# EAGLE schematic LEDSlave 5 (EAGLE 7.6.0)
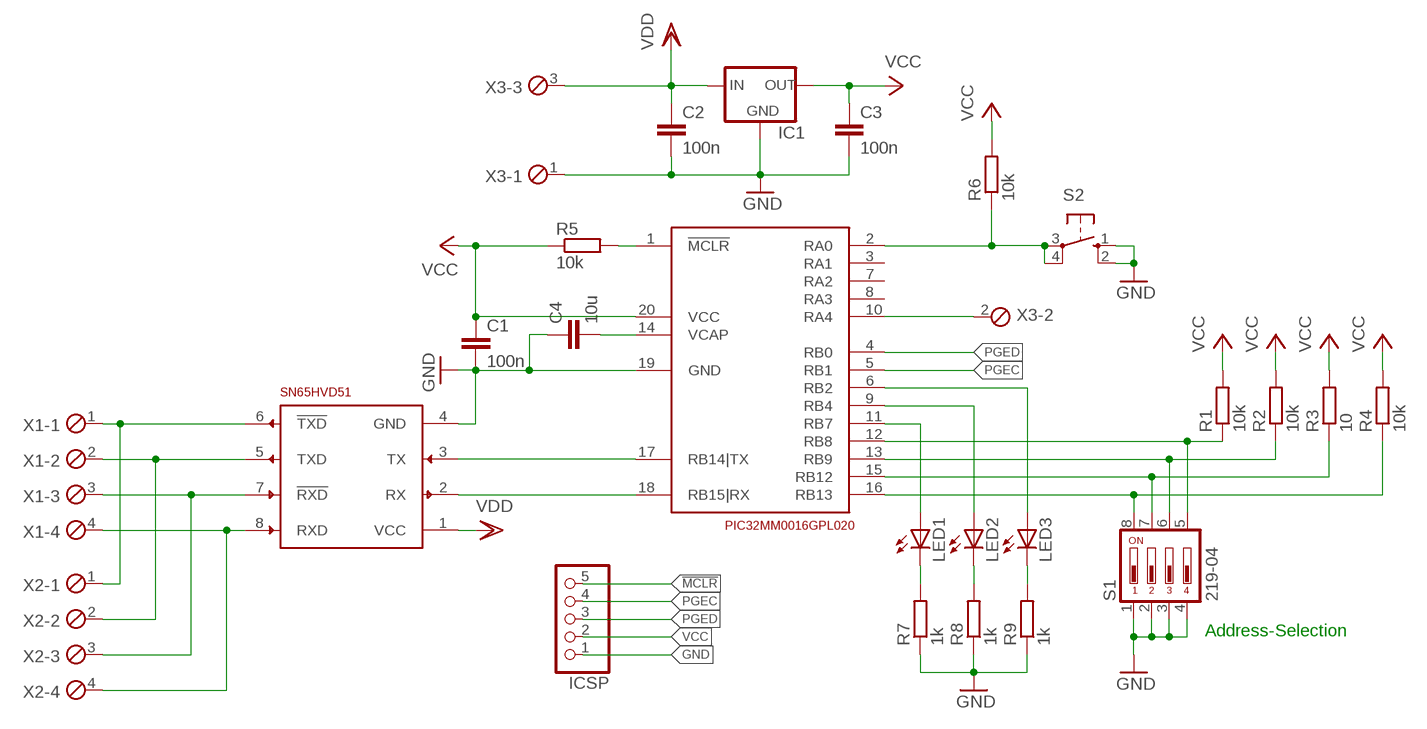
[diagram p0: schematic, sheet 1]

## Parts
C1  100n  C-EUC0805  [C0805]
C2  100n  C-EUC0805  [C0805]
C3  100n  C-EUC0805  [C0805]
C4  10u  C-EUC1206  [C1206]
IC1  LP2950CDT-3.3  [DPACK]
ICSP  PINHD-1X5  [1X05]
LED1  LED3MM  [LED3MM]
LED2  LED3MM  [LED3MM]
LED3  LED3MM  [LED3MM]
R1  10k  R-EU_R0805  [R0805]
R2  10k  R-EU_R0805  [R0805]
R3  10  R-EU_R0805  [R0805]
R4  10k  R-EU_R0805  [R0805]
R5  10k  R-EU_R0805  [R0805]
R6  10k  R-EU_R0805  [R0805]
R7  1k  R-EU_R0805  [R0805]
R8  1k  R-EU_R0805  [R0805]
R9  1k  R-EU_R0805  [R0805]
S1  219-04  [CTS-219-04]
S2  10-XX  [B3F-10XX]
U$1  PIC32MM0016GPL020  [SSOP20]
U$2  SN65HVD51  [SO-08]
X1  MPT4  [4POL254]
X2  MPT4  [4POL254]
X3  MPT3  [3POL254]

## Nets
!MCLR: ICSP.5 R5.2 U$1.1(!MCLR)
GND: C1.2 C2.2 C3.2 C4.1 IC1.4(GND) ICSP.1 R7.1 R8.1 R9.1 S1.1 S1.2 S1.3 S1.4 S2.1(S) S2.2(S1) U$1.19(GND) U$2.4(GND) X3.1
N$1: U$1.17(RB14|TX) U$2.3(TX)
N$2: U$1.18(RB15|RX) U$2.2(RX)
N$3: R4.1 S1.8 U$1.16(RB13)
N$4: R3.1 S1.7 U$1.15(RB12)
N$5: R2.1 S1.6 U$1.13(RB9)
N$6: R1.1 S1.5 U$1.12(RB8)
N$7: LED1.A U$1.11(RB7)
N$8: U$1.10(RA4) X3.2
N$9: R6.1 S2.3(P) S2.4(P1) U$1.2(RA0)
N$10: LED2.A U$1.9(RB4)
N$11: C4.2 U$1.14(VCAP)
N$12: U$2.7(!RXD) X1.3 X2.3
N$13: U$2.8(RXD) X1.4 X2.4
N$14: U$2.5(TXD) X1.2 X2.2
N$15: U$2.6(!TXD) X1.1 X2.1
N$16: LED3.A U$1.6(RB2)
N$17: LED1.K(C) R7.2
N$18: LED2.K(C) R8.2
N$19: LED3.K(C) R9.2
PGEC: ICSP.4 U$1.5(RB1)
PGED: ICSP.3 U$1.4(RB0)
VCC: C1.1 C3.1 IC1.3(OUT) ICSP.2 R1.2 R2.2 R3.2 R4.2 R5.1 R6.2 U$1.20(VCC)
VDD: C2.1 IC1.1(IN) U$2.1(VCC) X3.3
Unconnected: U$1.3(RA1) U$1.7(RA2) U$1.8(RA3)

## Notes on the sheet
- Address-Selection

## Library data of the parts
C1-C4 = rcl:C-EU: CAPACITOR, European symbol
IC1 = v-reg:LP2950?*: Source: http://cache.national.com/ds/LP/LP2950.pdf
ICSP = pinhead:PINHD-1X5: PIN HEADER
LED1-LED3 = led:LED: LED OSRAM: - CHIPLED LG R971, LG N971, LY N971, LG Q971, LY Q971, LO R971, LY R971 LH N974, LH R974 LS Q976, LO Q976, LY Q976 LO Q996 - Hyper CHIPLED LW Q18S LB Q993, LB Q99A, LB R99A - SideLED LS A670, LO A670, LY A670, LG A670, LP A670 LB A673, LV A673, LT A673, LW A673 LH A674 LY A675 LS A676, LA A676, LO A676, LY A676, LW A676 LS A679, LY A679, LG A679 - Hyper Micro SIDELED® LS Y876, LA Y876, LO Y876, LY Y876 LT Y87S - SmartLED LW L88C, LW L88S LB L89C, LB L89S, LG L890 LS L89K, LO L89K, LY L89K LS L896, LA L896, LO L896, LY L896 - TOPLED LS T670, LO T670, LY T670, LG T670, LP T670 LSG T670, LSP T670, LSY T670, LOP T670, LYG T670 LG T671, LOG T671, LSG T671 LB T673, LV T673, LT T673, LW T673 LH T674 LS T676, LA T676, LO T676, LY T676, LB T676, LH T676, LSB T676, LW T676 LB T67C, LV T67C, LT T67C, LS T67K, LO T67K, LY T67K, LW E67C LS E67B, LA E67B, LO E67B, LY E67B, LB E67C, LV E67C, LT E67C LW T67C LS T679, LY T679, LG T679 LS T770, LO T770, LY T770, LG T770, LP T770 LB T773, LV T773, LT T773, LW T773 LH T774 LS E675, LA E675, LY E675, LS T675 LS T776, LA T776, LO T776, LY T776, LB T776 LHGB T686 LT T68C, LB T68C - Hyper Mini TOPLED® LB M676 - Mini TOPLED Santana® LG M470 LS M47K, LO M47K, LY M47K Source: http://www.osram.convergy.de LUXEON: - LUMILED® LXK2-PW12-R00, LXK2-PW12-S00, LXK2-PW14-U00, LXK2-PW14-V00 LXK2-PM12-R00, LXK2-PM12-S00, LXK2-PM14-U00 LXK2-PE12-Q00, LXK2-PE12-R00, LXK2-PE12-S00, LXK2-PE14-T00, LXK2-PE14-U00 LXK2-PB12-K00, LXK2-PB12-L00, LXK2-PB12-M00, LXK2-PB14-N00, LXK2-PB14-P00, LXK2-PB14-Q00 LXK2-PR12-L00, LXK2-PR12-M00, LXK2-PR14-Q00, LXK2-PR14-R00 LXK2-PD12-Q00, LXK2-PD12-R00, LXK2-PD12-S00 LXK2-PH12-R00, LXK2-PH12-S00 LXK2-PL12-P00, LXK2-PL12-Q00, LXK2-PL12-R00 Source: www.luxeon.com KINGBRIGHT: KA-3528ASYC Source: www.kingbright.com
R1-R9 = rcl:R-EU_: RESISTOR, European symbol
S1 = switch-dil:219-04*: Surface Mount DIP Switch Series 219 SMT CTS Electronic Components Sourc: www.ctscorp.com; OC_FARNELL: unknown; OC_NEWARK: unknown
S2 = switch-omron:10-XX: OMRON SWITCH; MPN: B3F-1000; OC_FARNELL: 176432; OC_NEWARK: 36M3542
U$1 = PIC32MM0016GPL020:PIC32MM0016GPL020
U$2 = SN65HVD51 1:SN65HVD51
X1 X2 = con-phoenix-254:MPT4: PHOENIX CONNECTOR; OC_FARNELL: unknown; OC_NEWARK: unknown
X3 = con-phoenix-254:MPT3: PHOENIX CONNECTOR; OC_FARNELL: unknown; OC_NEWARK: unknown